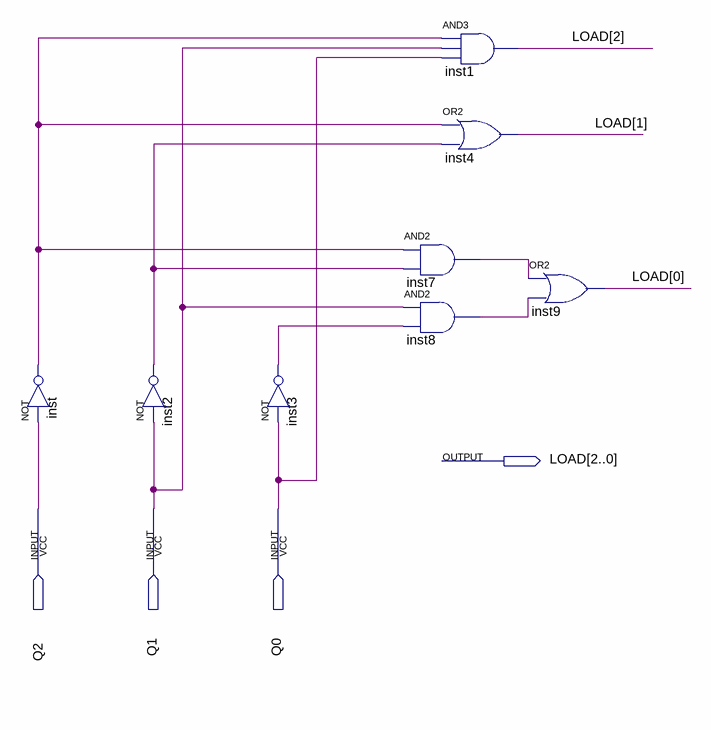
[diagram p0: schematic sheet]
// Quartus schematic LOAD_C2.bdf as structural Verilog: 8 symbols, 4 pins
module LOAD_C2 (
  input  Q2,
  input  Q1,
  input  Q0,
  output [2:0] LOAD
);

  wire inst2_out, inst3_out, inst7_out, inst8_out, inst_out;

  not inst (inst_out, Q2);
  not inst2 (inst2_out, Q1);
  not inst3 (inst3_out, Q0);
  and inst7 (inst7_out, inst_out, inst2_out);
  and inst8 (inst8_out, Q1, inst3_out);
  and inst1 (LOAD[2], inst_out, Q1, Q0);
  or inst4 (LOAD[1], inst_out, inst2_out);
  or inst9 (LOAD[0], inst7_out, inst8_out);
endmodule
